# Altium schematic sheet Power.SchDoc
size A3
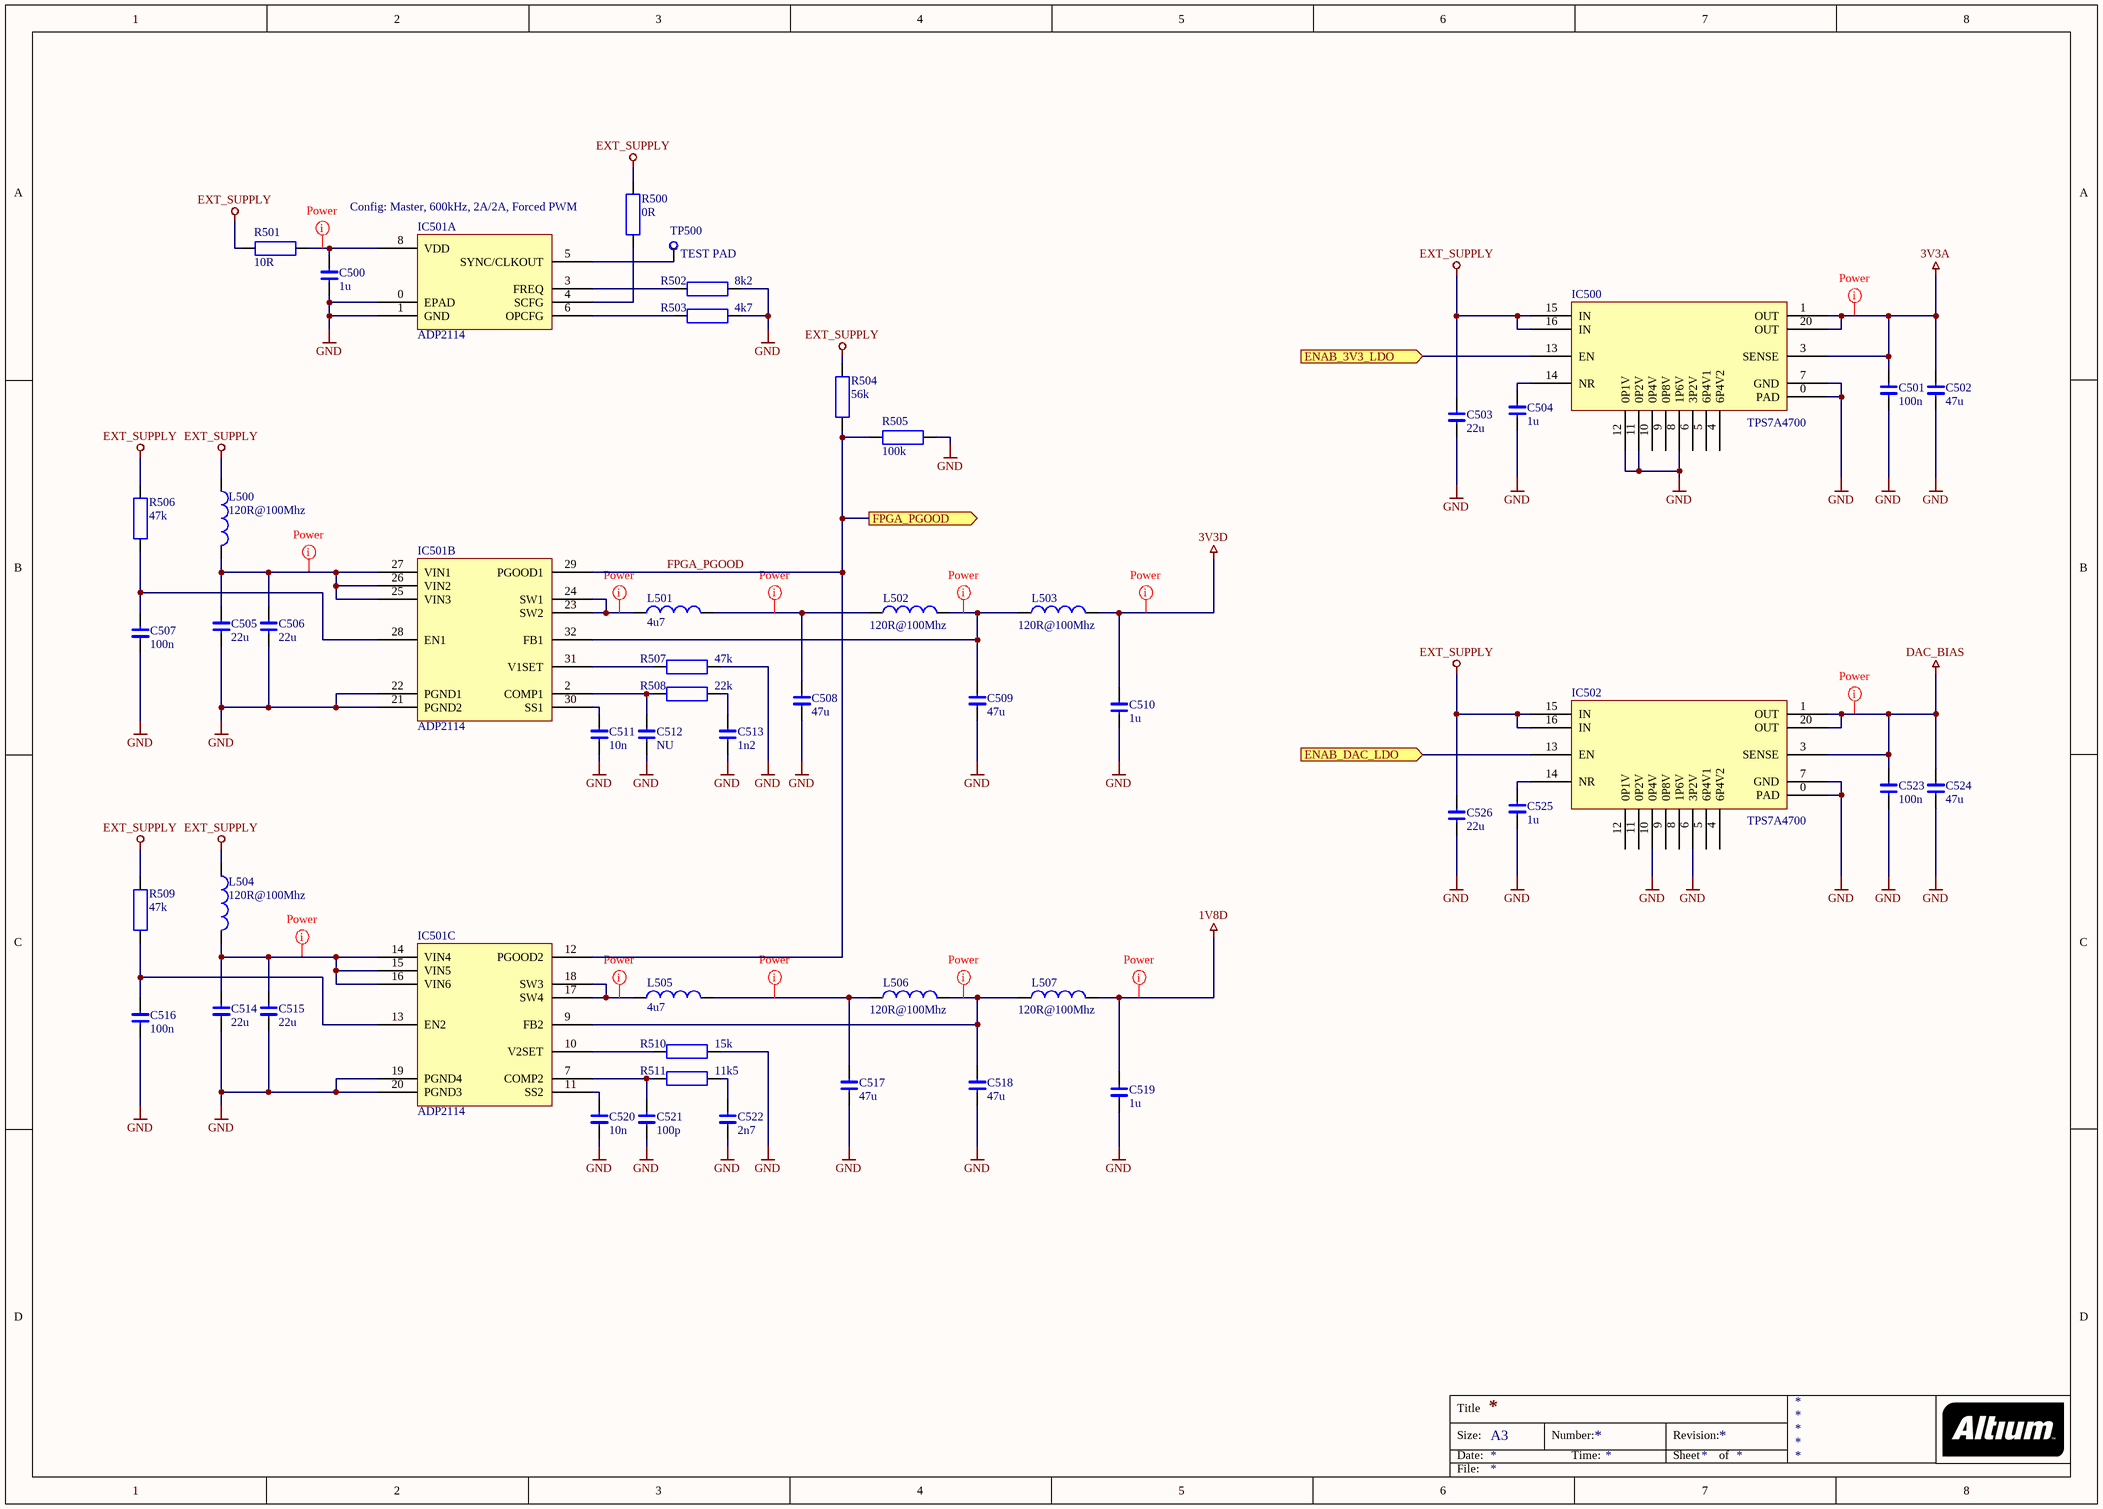
[diagram p0: Power.SchDoc]

## Parts
C500  1u  [0603 SMALL OUTLINE]
C501  100n  [0603 SMALL OUTLINE]
C502  47u  [1206]
C503  22u  [1206]
C504  1u  [0603 SMALL OUTLINE]
C505  22u  [1206]
C506  22u  [1206]
C507  100n  [0603 SMALL OUTLINE]
C508  47u  [1206]
C509  47u  [1206]
C510  1u  [0603 SMALL OUTLINE]
C511  10n  [0603 SMALL OUTLINE]
C512  NU  [0603 SMALL OUTLINE]
C513  1n2  [0603 SMALL OUTLINE]
C514  22u  [1206]
C515  22u  [1206]
C516  100n  [0603 SMALL OUTLINE]
C517  47u  [1206]
C518  47u  [1206]
C519  1u  [0603 SMALL OUTLINE]
C520  10n  [0603 SMALL OUTLINE]
C521  100p  [0603 SMALL OUTLINE]
C522  2n7  [0603 SMALL OUTLINE]
C523  100n  [0603 SMALL OUTLINE]
C524  47u  [1206]
C525  1u  [0603 SMALL OUTLINE]
C526  22u  [1206]
IC500  TPS7A4700  [VQFN20_LONG]
IC501  ADP2114  [LFCSP32_LONG]  (parts A,B,C of 3)
IC502  TPS7A4700  [VQFN20_LONG]
L500  120R@100Mhz  [0805]
L501  4u7  [DR74]
L502  120R@100Mhz  [0805]
L503  120R@100Mhz  [0805]
L504  120R@100Mhz  [0805]
L505  4u7  [DR74]
L506  120R@100Mhz  [0805]
L507  120R@100Mhz  [0805]
R500  0R  [0603 SMALL OUTLINE]
R501  10R  [0603 SMALL OUTLINE]
R502  8k2  [0603 SMALL OUTLINE]
R503  4k7  [0603 SMALL OUTLINE]
R504  56k  [0603 SMALL OUTLINE]
R505  100k  [0603 SMALL OUTLINE]
R506  47k  [0603 SMALL OUTLINE]
R507  47k  [0603 SMALL OUTLINE]
R508  22k  [0603 SMALL OUTLINE]
R509  47k  [0603 SMALL OUTLINE]
R510  15k  [0603 SMALL OUTLINE]
R511  11k5  [0603 SMALL OUTLINE]
TP500  TEST PAD  [TEST_PAD_50]

## Ports
ENAB_3V3_LDO (in), ENAB_DAC_LDO (in), FPGA_PGOOD (out)

## Nets
1V8D: C519.1 L507.2
3V3A: C501.1 C502.1 IC500.1(OUT) IC500.3(SENSE) IC500.20(OUT)
3V3D: C510.1 L503.2
DAC_BIAS: C523.1 C524.1 IC502.1(OUT) IC502.3(SENSE) IC502.20(OUT)
EXT_SUPPLY: C503.1 C526.1 IC500.15(IN) IC500.16(IN) IC502.15(IN) IC502.16(IN) L500.1 L504.1 R500.1 R501.2 R504.1 R506.2 R509.2
GND: C500.1 C501.2 C502.2 C503.2 C504.1 C505.2 C506.2 C507.2 C508.2 C509.2 C510.2 C511.2 C512.2 C513.2 C514.2 C515.2 C516.2 C517.2 C518.2 C519.2 C520.2 C521.2 C522.2 C523.2 C524.2 C525.1 C526.2 IC500.0(PAD) IC500.7(GND) IC500.8(1P6V) IC500.11(0P2V) IC500.12(0P1V) IC501.0(EPAD) IC501.1(GND) IC501.19(PGND4) IC501.20(PGND3) IC501.21(PGND2) IC501.22(PGND1) IC502.0(PAD) IC502.6(3P2V) IC502.7(GND) IC502.10(0P4V) R502.2 R503.2 R505.2 R507.2 R510.2
ENAB_3V3_LDO: IC500.13(EN) ; port ENAB_3V3_LDO
ENAB_DAC_LDO: IC502.13(EN) ; port ENAB_DAC_LDO
FPGA_PGOOD: IC501.12(PGOOD2) IC501.29(PGOOD1) R504.2 R505.1 ; port FPGA_PGOOD
NetC500_2: C500.2 IC501.8(VDD) R501.1
NetC504_2: C504.2 IC500.14(NR)
NetC505_1: C505.1 C506.1 IC501.25(VIN3) IC501.26(VIN2) IC501.27(VIN1) L500.2
NetC507_1: C507.1 IC501.28(EN1) R506.1
NetC508_1: C508.1 L501.2 L502.1
NetC509_1: C509.1 IC501.32(FB1) L502.2 L503.1
NetC511_1: C511.1 IC501.30(SS1)
NetC512_1: C512.1 IC501.2(COMP1) R508.1
NetC513_1: C513.1 R508.2
NetC514_1: C514.1 C515.1 IC501.14(VIN4) IC501.15(VIN5) IC501.16(VIN6) L504.2
NetC516_1: C516.1 IC501.13(EN2) R509.1
NetC517_1: C517.1 L505.2 L506.1
NetC518_1: C518.1 IC501.9(FB2) L506.2 L507.1
NetC520_1: C520.1 IC501.11(SS2)
NetC521_1: C521.1 IC501.7(COMP2) R511.1
NetC522_1: C522.1 R511.2
NetC525_2: C525.2 IC502.14(NR)
NetIC501_3: IC501.3(FREQ) R502.1
NetIC501_4: IC501.4(SCFG) R500.2
NetIC501_5: IC501.5(SYNC/CLKOUT) TP500.0
NetIC501_6: IC501.6(OPCFG) R503.1
NetIC501_10: IC501.10(V2SET) R510.1
NetIC501_17: IC501.17(SW4) IC501.18(SW3) L505.1
NetIC501_23: IC501.23(SW2) IC501.24(SW1) L501.1
NetIC501_31: IC501.31(V1SET) R507.1

Not connected (* = marked no-connect by the designer): IC500 4(6P4V2) 5(6P4V1) 6(3P2V) 9(0P8V) 10(0P4V); IC502 4(6P4V2) 5(6P4V1) 8(1P6V) 9(0P8V) 11(0P2V) 12(0P1V)

## Layout directives
net class Power: 1V8D, 3V3A, 3V3D, DAC_BIAS, NetC500_2, NetC505_1, NetC508_1, NetC509_1, NetC514_1, NetC517_1, NetC518_1, NetIC501_17, NetIC501_23

## Notes on the sheet
- Config: Master, 600kHz, 2A/2A, Forced PWM
- Title
- Size:
- Date:
- A3
- Number:
- Time:
- Revision:
- Sheet
- of
- File:

## Library data of the parts
C500-C526 = C
IC500 IC502 = TPS7A4700: 36V, 1A, Low Noise, RF LDO Voltage Regulator
IC501 = ADP2114: Configurable DC/DC Sync. Buck, Dual 2A / Single 4A
L500 L502-L504 L506 L507 = L: 742792023
L501 L505 = L: DR74-XXX-R
R500-R511 = R